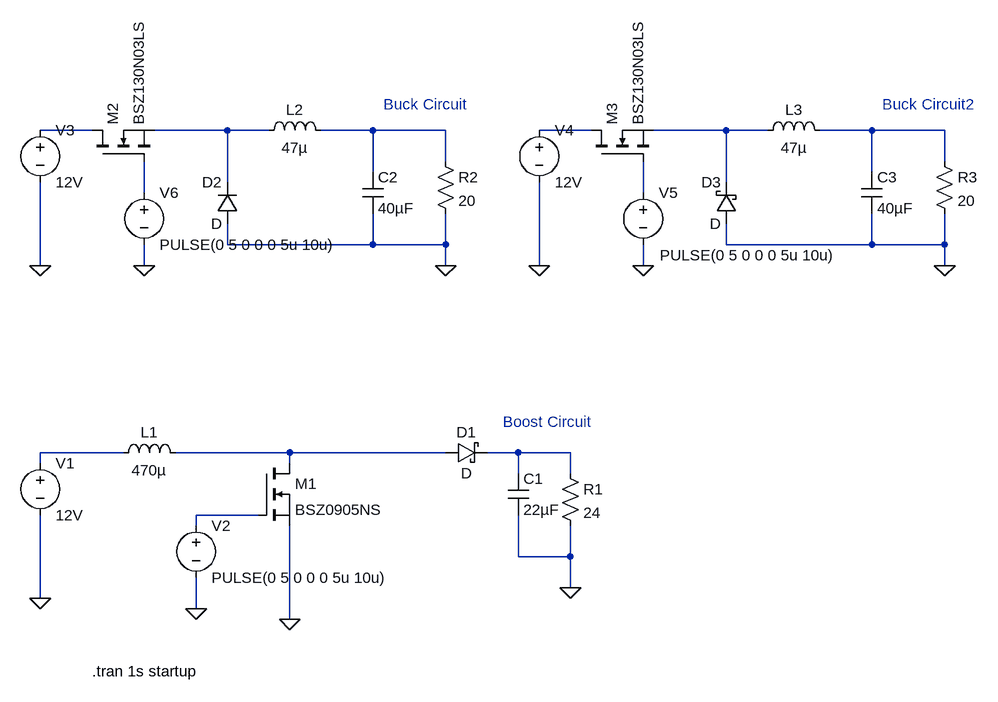
[diagram p0: schematic Simple_Buck_Boost.asc]
Simple_Buck_Boost.asc, the LTspice schematic file:
Version 4
SHEET 1 1148 724
WIRE -224 -480 -304 -480
WIRE -16 -480 -128 -480
WIRE 48 -480 -16 -480
WIRE 208 -480 128 -480
WIRE 320 -480 208 -480
WIRE 544 -480 464 -480
WIRE 752 -480 640 -480
WIRE 816 -480 752 -480
WIRE 976 -480 896 -480
WIRE 1088 -480 976 -480
WIRE 320 -432 320 -480
WIRE 1088 -432 1088 -480
WIRE 208 -416 208 -480
WIRE 976 -416 976 -480
WIRE -16 -400 -16 -480
WIRE 752 -400 752 -480
WIRE -144 -384 -144 -432
WIRE 624 -384 624 -432
WIRE -16 -304 -16 -336
WIRE 208 -304 208 -352
WIRE 208 -304 -16 -304
WIRE 320 -304 320 -352
WIRE 320 -304 208 -304
WIRE 752 -304 752 -336
WIRE 976 -304 976 -352
WIRE 976 -304 752 -304
WIRE 1088 -304 1088 -352
WIRE 1088 -304 976 -304
WIRE -304 -272 -304 -400
WIRE -144 -272 -144 -304
WIRE 320 -272 320 -304
WIRE 464 -272 464 -400
WIRE 624 -272 624 -304
WIRE 1088 -272 1088 -304
WIRE -176 16 -304 16
WIRE 80 16 -96 16
WIRE 320 16 80 16
WIRE 432 16 384 16
WIRE 512 16 432 16
WIRE -304 32 -304 16
WIRE 80 32 80 16
WIRE 432 48 432 16
WIRE 512 48 512 16
WIRE 32 112 -64 112
WIRE -64 128 -64 112
WIRE 432 176 432 112
WIRE 512 176 512 128
WIRE 512 176 432 176
WIRE 512 224 512 176
WIRE -304 240 -304 112
WIRE -64 256 -64 208
WIRE 80 272 80 128
FLAG -304 240 0
FLAG -64 256 0
FLAG 512 224 0
FLAG 80 272 0
FLAG -304 -272 0
FLAG 320 -272 0
FLAG -144 -272 0
FLAG 464 -272 0
FLAG 1088 -272 0
FLAG 624 -272 0
SYMBOL ind -192 32 R270
WINDOW 0 32 56 VTop 2
WINDOW 3 5 56 VBottom 2
SYMATTR InstName L1
SYMATTR Value 470µ
SYMBOL cap 416 48 R0
SYMATTR InstName C1
SYMATTR Value 22µF
SYMBOL res 496 32 R0
SYMATTR InstName R1
SYMATTR Value 24
SYMBOL voltage -304 16 R0
SYMATTR InstName V1
SYMATTR Value 12V
SYMBOL nmos 32 32 R0
SYMATTR InstName M1
SYMATTR Value BSZ0905NS
SYMBOL voltage -64 112 R0
WINDOW 123 0 0 Left 0
WINDOW 39 0 0 Left 0
SYMATTR InstName V2
SYMATTR Value PULSE(0 5 0 0 0 5u 10u)
SYMBOL schottky 320 32 R270
WINDOW 0 32 32 VTop 2
WINDOW 3 0 32 VBottom 2
SYMATTR InstName D1
SYMBOL voltage -304 -496 R0
SYMATTR InstName V3
SYMATTR Value 12V
SYMBOL nmos -224 -432 R270
SYMATTR InstName M2
SYMATTR Value BSZ130N03LS
SYMBOL diode 0 -336 R180
WINDOW 0 24 64 Left 2
WINDOW 3 24 0 Left 2
SYMATTR InstName D2
SYMBOL ind 32 -464 R270
WINDOW 0 32 56 VTop 2
WINDOW 3 5 56 VBottom 2
SYMATTR InstName L2
SYMATTR Value 47µ
SYMBOL cap 192 -416 R0
SYMATTR InstName C2
SYMATTR Value 40µF
SYMBOL res 304 -448 R0
SYMATTR InstName R2
SYMATTR Value 20
SYMBOL voltage -144 -400 R0
WINDOW 123 0 0 Left 0
WINDOW 39 0 0 Left 0
SYMATTR InstName V6
SYMATTR Value PULSE(0 5 0 0 0 5u 10u)
SYMBOL voltage 464 -496 R0
SYMATTR InstName V4
SYMATTR Value 12V
SYMBOL nmos 544 -432 R270
SYMATTR InstName M3
SYMATTR Value BSZ130N03LS
SYMBOL ind 800 -464 R270
WINDOW 0 32 56 VTop 2
WINDOW 3 5 56 VBottom 2
SYMATTR InstName L3
SYMATTR Value 47µ
SYMBOL cap 960 -416 R0
SYMATTR InstName C3
SYMATTR Value 40µF
SYMBOL res 1072 -448 R0
SYMATTR InstName R3
SYMATTR Value 20
SYMBOL voltage 624 -400 R0
WINDOW 123 0 0 Left 0
WINDOW 39 0 0 Left 0
WINDOW 3 26 112 Left 2
SYMATTR InstName V5
SYMATTR Value PULSE(0 5 0 0 0 5u 10u)
SYMBOL schottky 768 -336 R180
WINDOW 0 24 64 Left 2
WINDOW 3 24 0 Left 2
SYMATTR InstName D3
TEXT -224 352 Left 2 !.tran 1s startup
TEXT 408 -32 Left 2 ;Boost Circuit
TEXT 224 -520 Left 2 ;Buck Circuit
TEXT 992 -520 Left 2 ;Buck Circuit2

The netlist it stands for:
* Simple_Buck_Boost.asc
L1 N009 N010 470µ
C1 N011 0 22µF
R1 N011 0 24
V1 N009 0 12V
M1 N010 N012 0 0 BSZ0905NS
V2 N012 0 PULSE(0 5 0 0 0 5u 10u)
D1 N010 N011 D
V3 N001 0 12V
M2 N001 N007 N002 N002 BSZ130N03LS
D2 0 N002 D
L2 N002 N003 47µ
C2 N003 0 40µF
R2 N003 0 20
V6 N007 0 PULSE(0 5 0 0 0 5u 10u)
V4 N004 0 12V
M3 N004 N008 N005 N005 BSZ130N03LS
L3 N005 N006 47µ
C3 N006 0 40µF
R3 N006 0 20
V5 N008 0 PULSE(0 5 0 0 0 5u 10u)
D3 0 N005 D
.model D D
.lib standard.dio
.model NMOS NMOS
.model PMOS PMOS
.lib standard.mos
.tran 1s startup
* Boost Circuit
* Buck Circuit
* Buck Circuit2
.backanno
.end